# Altium schematic sheet 74LVC74AD.SchDoc
size A4
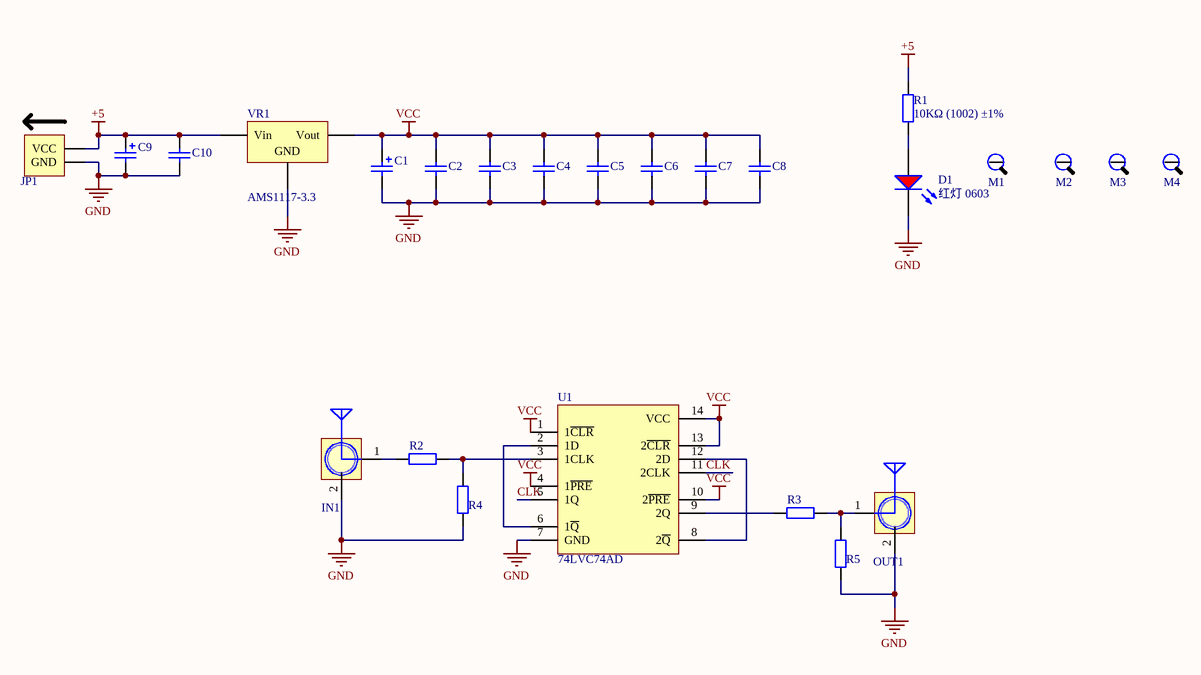
[diagram p0: 74LVC74AD.SchDoc]

## Parts
C1  10uF (106) ±10% 16V  [CASE-A_3216]  (value not drawn)
C2  100nF (104) 10% 50V  [0603_C]  (value not drawn)
C3  100nF (104) 10% 50V  [0603_C]  (value not drawn)
C4  100nF (104) 10% 50V  [0603_C]  (value not drawn)
C5  100nF (104) 10% 50V  [0603_C]  (value not drawn)
C6  100nF (104) 10% 50V  [0603_C]  (value not drawn)
C7  100nF (104) 10% 50V  [0603_C]  (value not drawn)
C8  100nF (104) 10% 50V  [0603_C]  (value not drawn)
C9  10uF (106) ±10% 16V  [CASE-A_3216]  (value not drawn)
C10  100nF (104) 10% 50V  [0603_C]  (value not drawn)
D1  红灯 0603  [0603_LED_S1]
IN1  SMA WIFI 天线接口  [SMA]  (value not drawn)
JP1  HDR-1X2  [Power_IN_3.81-2P]  (value not drawn)
M1  M3  [M3x10_L]  (value not drawn)
M2  M3  [M3x10_L]  (value not drawn)
M3  M3  [M3x10_L]  (value not drawn)
M4  M3  [M3x10_L]  (value not drawn)
OUT1  SMA WIFI 天线接口  [SMA]  (value not drawn)
R1  10KΩ (1002) ±1%  [0603_R]
R2  10KΩ (1002) ±1%  [0603_R]  (value not drawn)
R3  10KΩ (1002) ±1%  [0603_R]  (value not drawn)
R4  10KΩ (1002) ±1%  [0603_R]  (value not drawn)
R5  10KΩ (1002) ±1%  [0603_R]  (value not drawn)
U1  74LVC74AD  [SOIC_14]
VR1  AMS1117-3.3  [SOT-223]

## Nets
+5: C9.1 C10.2 JP1.1(VCC) R1.2 VR1.3(Vin)
GND: C1.2 C2.1 C3.1 C4.1 C5.1 C6.1 C7.1 C8.1 C9.2 C10.1 D1.K IN1.2 JP1.2(GND) OUT1.2 R4.2 R5.2 U1.7(GND) VR1.1(GND)
VCC: C1.1 C2.2 C3.2 C4.2 C5.2 C6.2 C7.2 C8.2 U1.1(1~{CLR}) U1.4(1~{PRE}) U1.10(2~{PRE}) U1.13(2~{CLR}) U1.14(VCC) VR1.2(Vout)
CLK: U1.5(1Q) U1.11(2CLK)
NetD1_A: D1.A R1.1
NetIN1_1: IN1.1(SINGLE) R2.2
NetOUT1_1: OUT1.1(SINGLE) R3.1 R5.1
NetR2_1: R2.1 R4.1 U1.3(1CLK)
NetR3_2: R3.2 U1.9(2Q)
NetU1_2: U1.2(1D) U1.6(1~{Q})
NetU1_8: U1.8(2~{Q}) U1.12(2D)

Not connected (* = marked no-connect by the designer): M1 1; M2 1; M3 1; M4 1

## Library data of the parts
C1 C9 = 3216 10uF (106) 10% 16V: 钽电容; ComponentLink1Description: 供应商链接; ComponentLink1URL: http://www.szlcsc.com/product/details_7643.html; Package: 3216; Supplier: LC; SuppliersPartNumber: C7171
C2-C8 C10 = 0603 100nF (104) 10% 50V: 贴片电容; ComponentLink1Description: 供应商链接; ComponentLink1URL: http://www.szlcsc.com/product/details_15331.html; Package: 0603; Supplier: LC; SuppliersPartNumber: C14663
D1 = 0603 红灯: 发光二极管; ComponentLink1Description: 供应商链接; ComponentLink1URL: http://www.szlcsc.com/product/details_2659.html; Package: 0603; Supplier: LC; SuppliersPartNumber: C2286
IN1 OUT1 = PORT_SMA: SMA-2.4G射频天线接口; 版权归属: 源创客; BOM名称: SMA-2.4G射频天线接口; 学习资源: www.ooocke.com
JP1 = PORT_Power_IN2: 2P接插件,模块单电源供电口; 版权归属: 源创客; BOM名称: 2P接插件; 学习资源: www.ooocke.com
M1-M4 = ELSE_M3_screw: 螺丝
R1-R5 = 0603 10KΩ (1002) 1%: 贴片电阻; ComponentLink1Description: 供应商链接; ComponentLink1URL: http://www.szlcsc.com/product/details_26547.html; Package: 0603; Supplier: LC; SuppliersPartNumber: C25804
VR1 = SOT-223 AMS1117-3.3: 低压差线性稳压(LDO); ComponentLink1Description: 供应商链接; ComponentLink1URL: http://www.szlcsc.com/product/details_6652.html; Package: SOT-223; Supplier: LC; SuppliersPartNumber: C6186